# EAGLE schematic SNCHN_II-03A (EAGLE 5.11)
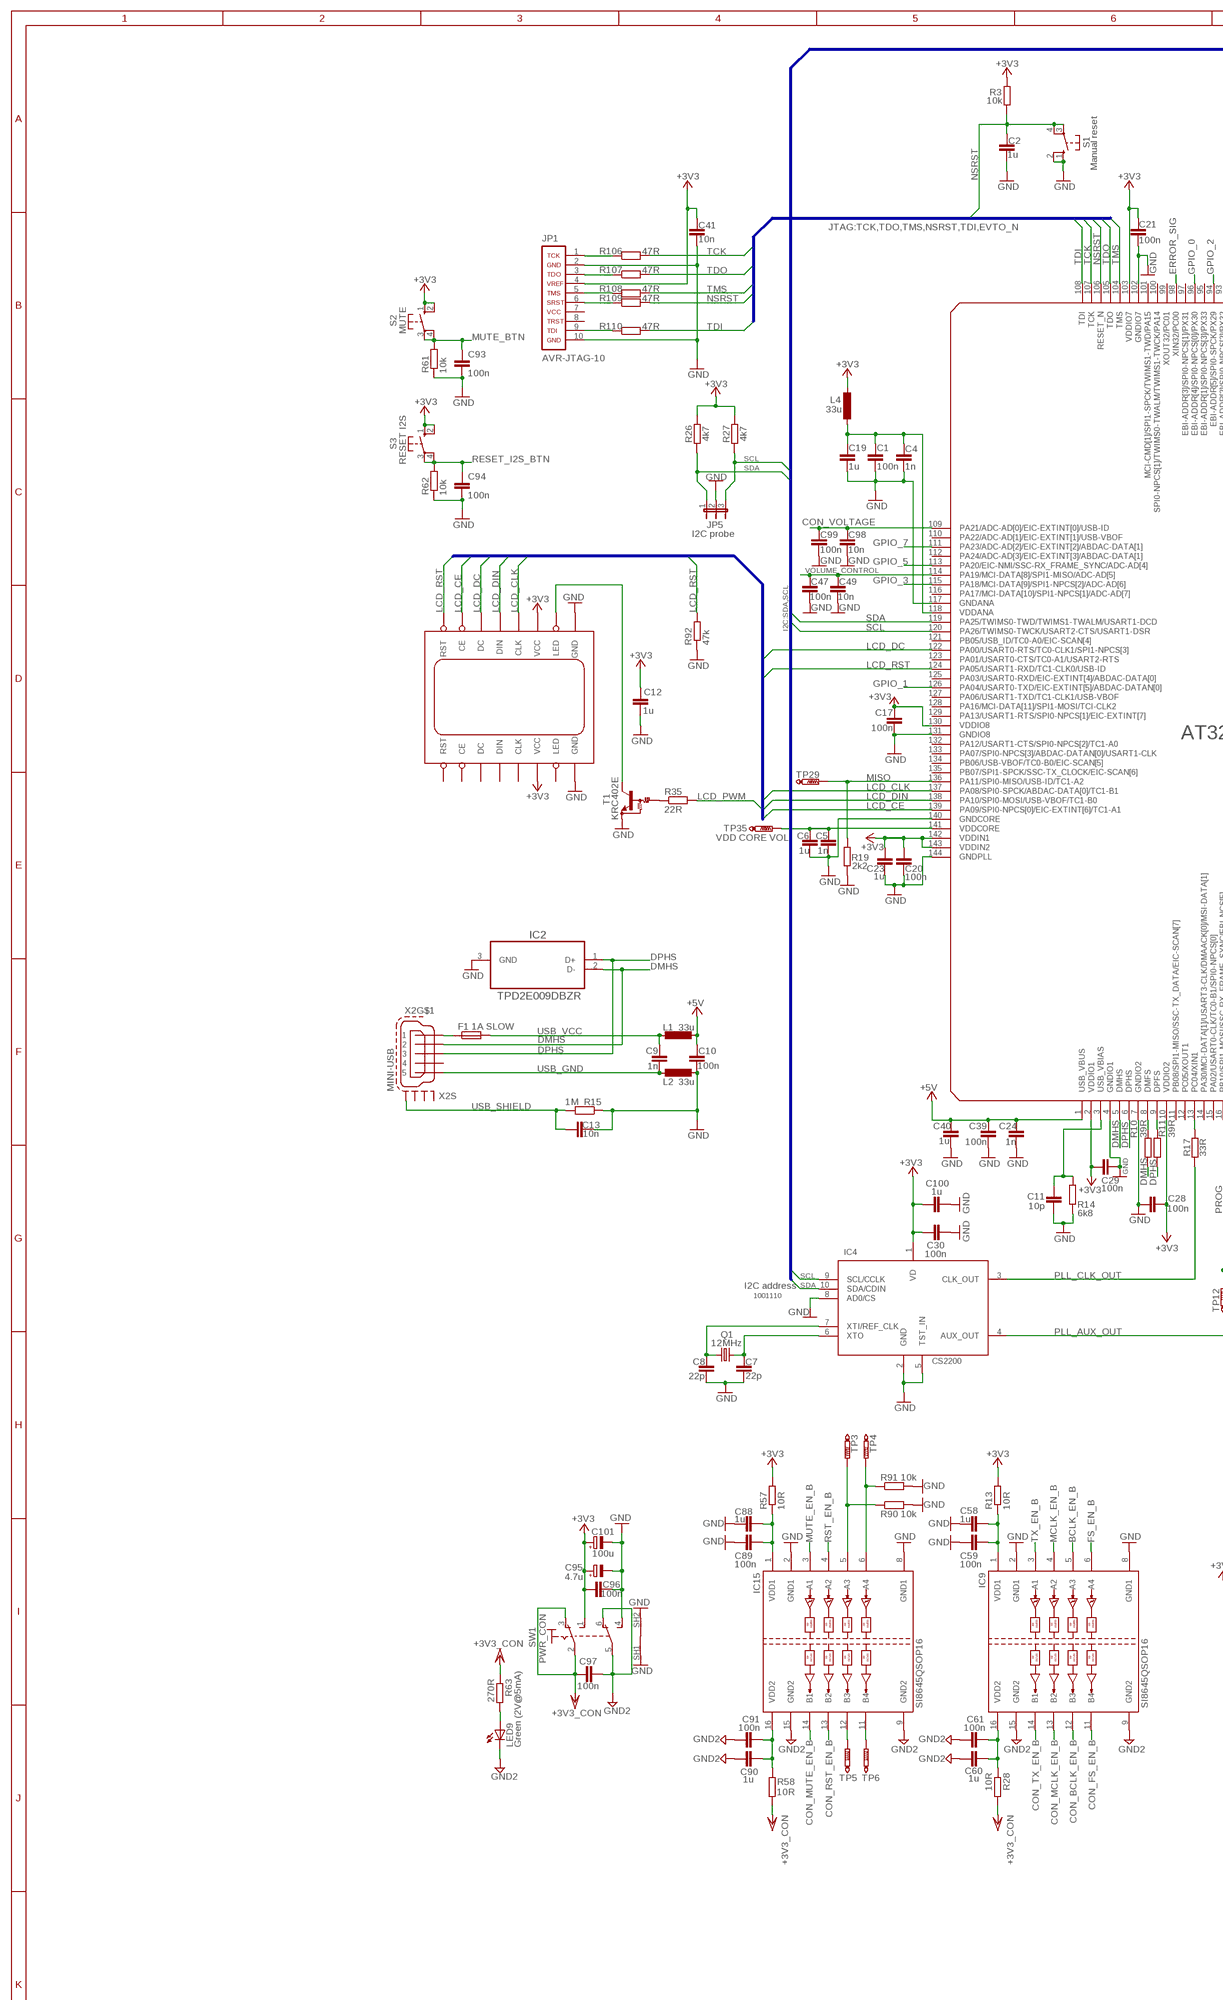
[diagram p0: schematic, sheet 1, part 1 of 3]
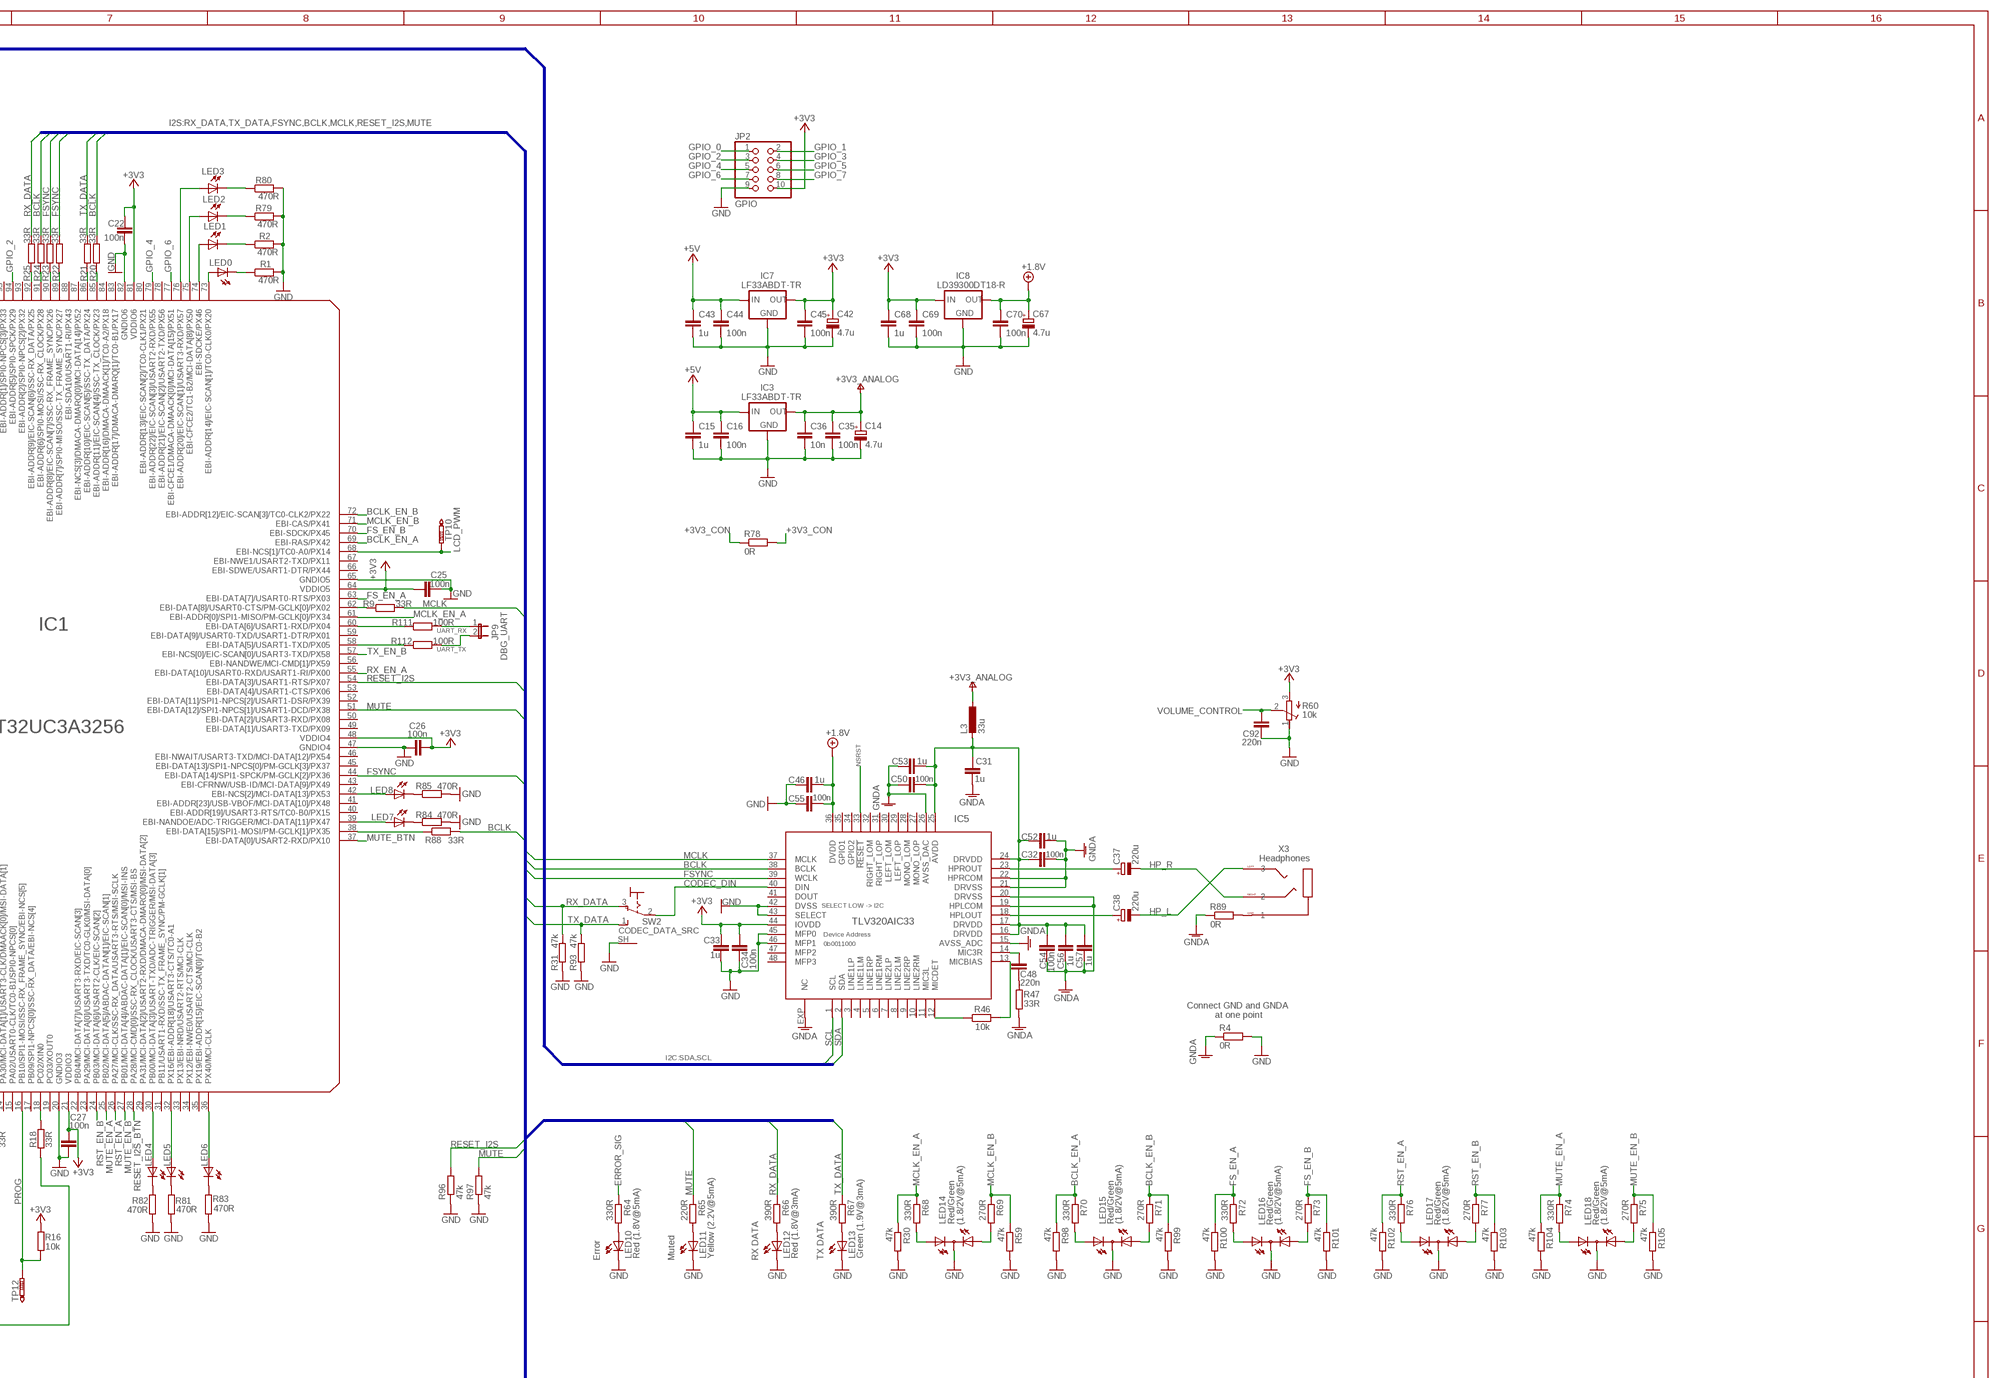
[diagram p1: schematic, sheet 1, part 2 of 3]
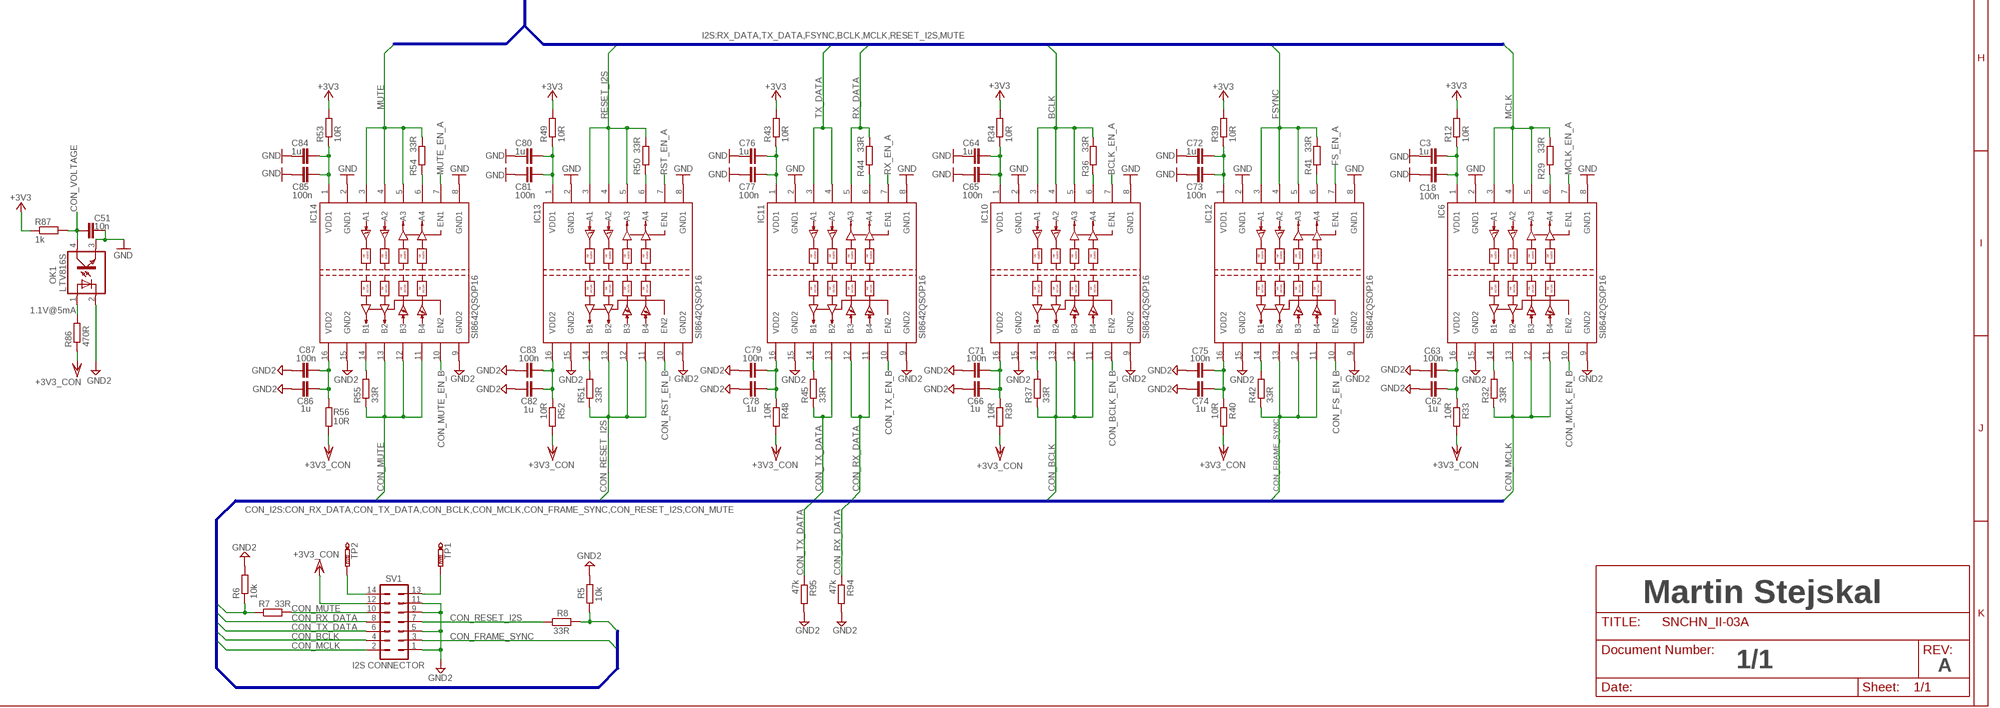
[diagram p2: schematic, sheet 1, part 3 of 3]

## Parts
C1  100n  C-EUC0402  [C0402]
C2  1u  C-EUC0603  [C0603]
C3  1u  C-EUC0603  [C0603]
C4  1n  C-EUC0402  [C0402]
C5  1n  C-EUC0402  [C0402]
C6  1u  C-EUC0603  [C0603]
C7  22p  C-EUC0603  [C0603]
C8  22p  C-EUC0603  [C0603]
C9  1n  C-EUC0603  [C0603]
C10  100n  C-EUC0603  [C0603]
C11  10p  C-EUC0402  [C0402]
C12  1u  C-EUC0603  [C0603]
C13  10n  C-EUC0603  [C0603]
C14  4.7u  CPOL-EUSMCA  [SMC_A]
C15  1u  C0603R  [C0603R]
C16  100n  C-EUC0402  [C0402]
C17  100n  C-EUC0402  [C0402]
C18  100n  C-EUC0402  [C0402]
C19  1u  C-EUC0603  [C0603]
C20  100n  C-EUC0402  [C0402]
C21  100n  C-EUC0402  [C0402]
C22  100n  C-EUC0402  [C0402]
C23  1u  C-EUC0603  [C0603]
C24  1n  C-EUC0402  [C0402]
C25  100n  C-EUC0402  [C0402]
C26  100n  C-EUC0402  [C0402]
C27  100n  C-EUC0402  [C0402]
C28  100n  C-EUC0402  [C0402]
C29  100n  C-EUC0402  [C0402]
C30  100n  C-EUC0402  [C0402]
C31  1u  C-EUC0603  [C0603]
C32  100n  C-EUC0402  [C0402]
C33  1u  C-EUC0603  [C0603]
C34  100n  C-EUC0402  [C0402]
C35  100n  C-EUC0603  [C0603]
C36  10n  C-EUC0603  [C0603]
C37  220u  CPOL-EU140CLH-1010  [140CLH-1010]
C38  220u  CPOL-EU140CLH-1010  [140CLH-1010]
C39  100n  C-EUC0402  [C0402]
C40  1u  C-EUC0603  [C0603]
C41  10n  C-EUC0603  [C0603]
C42  4.7u  CPOL-EUSMCA  [SMC_A]
C43  1u  C0603R  [C0603R]
C44  100n  C-EUC0603  [C0603]
C45  100n  C-EUC0603  [C0603]
C46  1u  C-EUC0603  [C0603]
C47  100n  C-EUC0402  [C0402]
C48  220n  C-EUC0402  [C0402]
C49  10n  C-EUC0402  [C0402]
C50  100n  C-EUC0402  [C0402]
C51  10n  C-EUC0402  [C0402]
C52  1u  C-EUC0603  [C0603]
C53  1u  C-EUC0603  [C0603]
C54  100n  C-EUC0402  [C0402]
C55  100n  C-EUC0402  [C0402]
C56  1u  C-EUC0603  [C0603]
C57  1u  C-EUC0603  [C0603]
C58  1u  C-EUC0603  [C0603]
C59  100n  C-EUC0402  [C0402]
C60  1u  C-EUC0603  [C0603]
C61  100n  C-EUC0402  [C0402]
C62  1u  C-EUC0603  [C0603]
C63  100n  C-EUC0402  [C0402]
C64  1u  C-EUC0603  [C0603]
C65  100n  C-EUC0402  [C0402]
C66  1u  C-EUC0603  [C0603]
C67  4.7u  CPOL-EUSMCA  [SMC_A]
C68  1u  C0603R  [C0603R]
C69  100n  C-EUC0402  [C0402]
C70  100n  C-EUC0402  [C0402]
C71  100n  C-EUC0402  [C0402]
C72  1u  C-EUC0603  [C0603]
C73  100n  C-EUC0402  [C0402]
C74  1u  C-EUC0603  [C0603]
C75  100n  C-EUC0402  [C0402]
C76  1u  C-EUC0603  [C0603]
C77  100n  C-EUC0402  [C0402]
C78  1u  C-EUC0603  [C0603]
C79  100n  C-EUC0402  [C0402]
C80  1u  C-EUC0603  [C0603]
C81  100n  C-EUC0402  [C0402]
C82  1u  C-EUC0603  [C0603]
C83  100n  C-EUC0402  [C0402]
C84  1u  C-EUC0603  [C0603]
C85  100n  C-EUC0402  [C0402]
C86  1u  C-EUC0603  [C0603]
C87  100n  C-EUC0402  [C0402]
C88  1u  C-EUC0603  [C0603]
C89  100n  C-EUC0402  [C0402]
C90  1u  C-EUC0603  [C0603]
C91  100n  C-EUC0402  [C0402]
C92  220n  C-EUC0402  [C0402]
C93  100n  C-EUC0402  [C0402]
C94  100n  C-EUC0402  [C0402]
C95  4.7u  CPOL-EUSMCA  [SMC_A]
C96  100n  C-EUC0402  [C0402]
C97  100n  C-EUC0402  [C0402]
C98  10n  C-EUC0402  [C0402]
C99  100n  C-EUC0402  [C0402]
C100  1u  C-EUC0603  [C0603]
C101  100u  CPOL-EUSMCD  [SMC_D]
DISPLAY  LCD_NOKIA_5510  [LCD_NOKIA_5510_PLUS_EXT_BRD]
F1  1A SLOW  R-EU_M1206  [M1206]
IC1  AT32UC3A3256  AT32UC3A3256/3128/364  [LQFP144]
IC2  TPD2E009DBZR  [SOT95P237X112-3N]
IC3  LF33ABDT-TR  LP2950CDTX-3.3  [DPACK]
IC4  CS2200  [MSOP10]
IC5  TLV320AIC33  [QFN48]
IC6  SI8642QSOP16  [QSOP16]
IC7  LF33ABDT-TR  LP2950CDTX-3.3  [DPACK]
IC8  LD39300DT18-R  LP2950CDTX-3.3  [DPACK]
IC9  SI8645QSOP16  [QSOP16]
IC10  SI8642QSOP16  [QSOP16]
IC11  SI8642QSOP16  [QSOP16]
IC12  SI8642QSOP16  [QSOP16]
IC13  SI8642QSOP16  [QSOP16]
IC14  SI8642QSOP16  [QSOP16]
IC15  SI8645QSOP16  [QSOP16]
JP1  AVR-JTAG-10  [AVR-JTAG-10]
JP2  GPIO  PINHD-2X5  [2X05]
JP5  I2C probe  JP2E  [JP2]
JP9  DBG_UART  JP1E  [JP1]
L1  33u  L0805  [L0805]
L2  33u  L0805  [L0805]
L3  33u  L0805  [L0805]
L4  33u  L0805  [L0805]
LED0  LEDCHIP-LED0603  [CHIP-LED0603]
LED1  LEDCHIP-LED0603  [CHIP-LED0603]
LED2  LEDCHIP-LED0603  [CHIP-LED0603]
LED3  LEDCHIP-LED0603  [CHIP-LED0603]
LED4  LEDCHIP-LED0603  [CHIP-LED0603]
LED5  LEDCHIP-LED0603  [CHIP-LED0603]
LED6  LEDCHIP-LED0603  [CHIP-LED0603]
LED7  LEDCHIP-LED0603  [CHIP-LED0603]
LED8  LEDCHIP-LED0603  [CHIP-LED0603]
LED9  Green (2V@5mA)  LED3MM  [LED3MM]
LED10  Red (1.8V@5mA)  LED3MM  [LED3MM]
LED11  Yellow (2.2V@5mA)  LED3MM  [LED3MM]
LED12  Red (1.8V@3mA)  LED3MM  [LED3MM]
LED13  Green (1.9V@3mA)  LED3MM  [LED3MM]
LED14  Red/Green  DUO_LED_C3MM  [DUOLED-C-3MM]
LED15  Red/Green  DUO_LED_C3MM  [DUOLED-C-3MM]
LED16  Red/Green  DUO_LED_C3MM  [DUOLED-C-3MM]
LED17  Red/Green  DUO_LED_C3MM  [DUOLED-C-3MM]
LED18  Red/Green  DUO_LED_C3MM  [DUOLED-C-3MM]
OK1  LTV816S  [SMD4]
Q1  12MHz  CRYSTALHC49U-V  [HC49U-V]
R1  470R  R-EU_R0402  [R0402]
R2  470R  R-EU_R0402  [R0402]
R3  10k  R-EU_R0603  [R0603]
R4  0R  R-EU_R1206  [R1206]
R5  10k  R-EU_R0603  [R0603]
R6  10k  R-EU_R0603  [R0603]
R7  33R  R-EU_R0603  [R0603]
R8  33R  R-EU_R0603  [R0603]
R9  33R  R-EU_R0402  [R0402]
R10  39R  R-EU_R0603  [R0603]
R11  39R  R-EU_R0603  [R0603]
R12  10R  R-EU_R0603  [R0603]
R13  10R  R-EU_R0603  [R0603]
R14  6k8  R-EU_R0402  [R0402]
R15  1M  R-EU_R0603  [R0603]
R16  10k  R-EU_R0402  [R0402]
R17  33R  R-EU_R0402  [R0402]
R18  33R  R-EU_R0402  [R0402]
R19  2k2  R-EU_R0402  [R0402]
R20  33R  R-EU_R0402  [R0402]
R21  33R  R-EU_R0402  [R0402]
R22  33R  R-EU_R0402  [R0402]
R23  33R  R-EU_R0402  [R0402]
R24  33R  R-EU_R0402  [R0402]
R25  33R  R-EU_R0402  [R0402]
R26  4k7  R-EU_R0603  [R0603]
R27  4k7  R-EU_R0603  [R0603]
R28  10R  R-EU_R0603  [R0603]
R29  33R  R-EU_R0402  [R0402]
R30  47k  R-EU_R0603  [R0603]
R31  47k  R-EU_R0402  [R0402]
R32  33R  R-EU_R0402  [R0402]
R33  10R  R-EU_R0603  [R0603]
R34  10R  R-EU_R0603  [R0603]
R35  22R  R-EU_R0603  [R0603]
R36  33R  R-EU_R0402  [R0402]
R37  33R  R-EU_R0402  [R0402]
R38  10R  R-EU_R0603  [R0603]
R39  10R  R-EU_R0603  [R0603]
R40  10R  R-EU_R0603  [R0603]
R41  33R  R-EU_R0402  [R0402]
R42  33R  R-EU_R0402  [R0402]
R43  10R  R-EU_R0603  [R0603]
R44  33R  R-EU_R0402  [R0402]
R45  33R  R-EU_R0402  [R0402]
R46  10k  R-EU_R0402  [R0402]
R47  33R  R-EU_R0402  [R0402]
R48  10R  R-EU_R0603  [R0603]
R49  10R  R-EU_R0603  [R0603]
R50  33R  R-EU_R0402  [R0402]
R51  33R  R-EU_R0402  [R0402]
R52  10R  R-EU_R0603  [R0603]
R53  10R  R-EU_R0603  [R0603]
R54  33R  R-EU_R0402  [R0402]
R55  33R  R-EU_R0402  [R0402]
R56  10R  R-EU_R0603  [R0603]
R57  10R  R-EU_R0603  [R0603]
R58  10R  R-EU_R0603  [R0603]
R59  47k  R-EU_R0603  [R0603]
R60  10k  R-TRIMALPSRK09K1110AK4  [TRIM_RK09K1110AK4]
R61  10k  R-EU_R0402  [R0402]
R62  10k  R-EU_R0402  [R0402]
R63  270R  R-EU_R0603  [R0603]
R64  330R  R-EU_R0603  [R0603]
R65  220R  R-EU_R0603  [R0603]
R66  390R  R-EU_R0603  [R0603]
R67  390R  R-EU_R0603  [R0603]
R68  330R  R-EU_R0603  [R0603]
R69  270R  R-EU_R0603  [R0603]
R70  330R  R-EU_R0603  [R0603]
R71  270R  R-EU_R0603  [R0603]
R72  330R  R-EU_R0603  [R0603]
R73  270R  R-EU_R0603  [R0603]
R74  330R  R-EU_R0603  [R0603]
R75  270R  R-EU_R0603  [R0603]
R76  330R  R-EU_R0603  [R0603]
R77  270R  R-EU_R0603  [R0603]
R78  0R  R-EU_R1206  [R1206]
R79  470R  R-EU_R0402  [R0402]
R80  470R  R-EU_R0402  [R0402]
R81  470R  R-EU_R0402  [R0402]
R82  470R  R-EU_R0402  [R0402]
R83  470R  R-EU_R0402  [R0402]
R84  470R  R-EU_R0402  [R0402]
R85  470R  R-EU_R0402  [R0402]
R86  470R  R-EU_R0402  [R0402]
R87  1k  R-EU_R0603  [R0603]
R88  33R  R-EU_R0402  [R0402]
R89  0R  R-EU_R0603  [R0603]
R90  10k  R-EU_R0402  [R0402]
R91  10k  R-EU_R0402  [R0402]
R92  47k  R-EU_R0402  [R0402]
R93  47k  R-EU_R0402  [R0402]
R94  47k  R-EU_R0402  [R0402]
R95  47k  R-EU_R0402  [R0402]
R96  47k  R-EU_R0603  [R0603]
R97  47k  R-EU_R0603  [R0603]
R98  47k  R-EU_R0603  [R0603]
R99  47k  R-EU_R0603  [R0603]
R100  47k  R-EU_R0603  [R0603]
R101  47k  R-EU_R0603  [R0603]
R102  47k  R-EU_R0603  [R0603]
R103  47k  R-EU_R0603  [R0603]
R104  47k  R-EU_R0603  [R0603]
R105  47k  R-EU_R0603  [R0603]
R106  47R  R-EU_R0402  [R0402]
R107  47R  R-EU_R0402  [R0402]
R108  47R  R-EU_R0402  [R0402]
R109  47R  R-EU_R0603  [R0603]
R110  47R  R-EU_R0402  [R0402]
R111  100R  R-EU_R0402  [R0402]
R112  100R  R-EU_R0402  [R0402]
S1  Manual reset  10-XX  [B3F-10XX]
S2  MUTE  10-XX  [B3F-10XX]
S3  RESET I2S  10-XX  [B3F-10XX]
SV1  I2S CONNECTOR  ML14L  [ML14L]
SW1  PWR_CON  THROUGH_HOLE_2_POLES_SHILEDTOOGLE_SWITCH  [1MD3T2B4M7XX]
SW2  CODEC_DATA_SRC  THROUGH_HOLE_1_POLE_SHIELD_1XTOOGLE_SWITCH  [2AS2T2A1M7RE]
T1  KRC402E  MUN2211T1-NPN_DRIVER-SC59-BEC  [SC59-BEC]
TP1  PTR1B1,27  [B1,27]
TP2  PTR1B1,27  [B1,27]
TP3  PTR1TP06R  [TP06R]
TP4  PTR1TP06R  [TP06R]
TP5  PTR1TP06R  [TP06R]
TP6  PTR1TP06R  [TP06R]
TP10  PTR1B1,27  [B1,27]
TP12  PTR1PAD1-13  [P1-13]
TP29  PTR1B1,27  [B1,27]
TP35  PTR1B1,27  [B1,27]
X2  MINI-USB  MINI-USB-SCHIELD-32005-201  [32005-201]
X3  Headphones  JACK_CON_3.5MM_3PIN  [STEREO_JACK_3.5MM_SMD_SJ-352X-SMT]

## Nets
+1.8V: C46.1 C55.1 C67.+ C70.1 IC5.36(DVDD) IC8.3(OUT)
+3V3: C12.1 C17.1 C20.1 C21.1 C22.1 C23.1 C25.1 C26.1 C27.1 C28.2 C29.1 C30.1 C33.1 C34.1 C41.1 C42.+ C45.1 C68.1 C69.1 C95.+ C96.1 C100.1 C101.+ DISPLAY.6(VCC) DISPLAY.6@1(VCC) IC1.2(VDDIO1) IC1.10(VDDIO2) IC1.21(VDDIO3) IC1.48(VDDIO4) IC1.64(VDDIO5) IC1.81(VDDIO6) IC1.103(VDDIO7) IC1.130(VDDIO8) IC1.142(VDDIN1) IC1.143(VDDIN2) IC4.1(VD) IC5.44(IOVDD) IC7.3(OUT) IC8.1(IN) JP1.4 JP2.10 L4.2 R3.2 R12.2 R13.2 R16.2 R26.2 R27.2 R34.2 R39.2 R43.2 R49.2 R53.2 R57.2 R60.3 R87.1 S2.1(S) S2.2(S1) S3.1(S) S3.2(S1) SW1.1(S)
+3V3_ANALOG: C14.+ C35.1 C36.1 IC3.3(OUT) L3.1
+3V3_CON: C97.1 R28.2 R33.2 R38.2 R40.2 R48.2 R52.2 R56.2 R58.2 R63.1 R78.1 R78.2 R86.1 SV1.12 SW1.2(P) SW1.3(O)
+5V: C10.1 C15.1 C16.1 C24.1 C39.1 C40.1 C43.1 C44.1 IC1.1(USB_VBUS) IC3.1(IN) IC7.1(IN) L1.2
ANALOG_VCC: C31.1 C32.2 C50.1 C52.2 C53.1 C54.2 C56.2 C57.2 IC5.16(DRVDD) IC5.17(DRVDD) IC5.24(DRVDD) IC5.25(AVDD) L3.2
BCLK [High Speed]: IC5.38(BCLK) IC10.3(A1) IC10.4(A2) IC10.5(A3) R20.2 R24.2 R36.2 R88.2
BCLK_EN_A: IC1.69(EBI-RAS/PX42) IC10.7(EN1) R70.1 R98.1
BCLK_EN_B: IC1.72(EBI-ADDR[12]/EIC-SCAN[3]/TC0-CLK2/PX22) IC9.5(A3) R71.1 R99.1
CODEC_DIN: IC5.40(DIN) SW2.2(P)
CON_BCLK [High Speed]: IC10.11(B4) IC10.12(B3) IC10.13(B2) R37.1 SV1.4
CON_BCLK_EN_B: IC9.12(B3) IC10.10(EN2)
CON_FRAME_SYNC: IC12.11(B4) IC12.12(B3) IC12.13(B2) R42.1 SV1.3
CON_FS_EN_B: IC9.11(B4) IC12.10(EN2)
CON_MCLK [High Speed]: IC6.11(B4) IC6.12(B3) IC6.13(B2) R32.1 SV1.2
CON_MCLK_EN_B: IC6.10(EN2) IC9.13(B2)
CON_MUTE: IC14.11(B4) IC14.12(B3) IC14.13(B2) R6.1 R7.1 R55.1
CON_MUTE_EN_B: IC14.10(EN2) IC15.14(B1)
CON_RESET_I2S: IC13.11(B4) IC13.12(B3) IC13.13(B2) R5.1 R8.2 R51.1
CON_RST_EN_B: IC13.10(EN2) IC15.13(B2)
CON_RX_DATA [High Speed]: IC11.11(B4) IC11.12(B3) R94.1 SV1.8
CON_TX_DATA [High Speed]: IC11.13(B2) R45.1 R95.1 SV1.6
CON_TX_EN_B: IC9.14(B1) IC11.10(EN2)
CON_VOLTAGE: C51.1 C98.1 C99.1 IC1.109(PA21/ADC-AD[0]/EIC-EXTINT[0]/USB-ID) OK1.4(COL) R87.2
DMHS: IC1.5(DMHS) IC2.2(D-) R10.1 X2.2
DPHS: IC1.6(DPHS) IC2.1(D+) R11.1 X2.3
ERROR_SIG: IC1.98(XIN32/PC00) R64.1
FS_EN_A: IC1.63(EBI-DATA[7]/USART0-RTS/PX03) IC12.7(EN1) R72.1 R100.1
FS_EN_B: IC1.70(EBI-SDCK/PX45) IC9.6(A4) R73.1 R101.1
FSYNC: IC1.44(EBI-DATA[14]/SPI1-SPCK/PM-GCLK[2]/PX36) IC5.39(WCLK) IC12.3(A1) IC12.4(A2) IC12.5(A3) R22.2 R23.2 R41.2
GND: C1.2 C2.2 C3.2 C4.2 C5.2 C6.2 C7.2 C8.2 C10.2 C11.2 C12.2 C13.2 C14.- C15.2 C16.2 C17.2 C18.2 C19.2 C20.2 C21.2 C22.2 C23.2 C24.2 C25.2 C26.2 C27.2 C28.1 C29.2 C30.2 C33.2 C34.2 C35.2 C36.2 C39.2 C40.2 C41.2 C42.- C43.2 C44.2 C45.2 C46.2 C47.2 C49.2 C51.2 C55.2 C58.2 C59.2 C64.2 C65.2 C67.- C68.2 C69.2 C70.2 C72.2 C73.2 C76.2 C77.2 C80.2 C81.2 C84.2 C85.2 C88.2 C89.2 C92.2 C93.2 C94.2 C95.- C96.2 C98.2 C99.2 C100.2 C101.- DISPLAY.8(GND) DISPLAY.8@1(GND) IC1.4(GNDIO1) IC1.7(GNDIO2) IC1.20(GNDIO3) IC1.47(GNDIO4) IC1.65(GNDIO5) IC1.82(GNDIO6) IC1.102(GNDIO7) IC1.117(GNDANA) IC1.131(GNDIO8) IC1.140(GNDCORE) IC1.144(GNDPLL) IC2.3(GND) IC3.4(GND) IC4.2(GND) IC4.5(TST_IN) IC4.8(AD0/CS) IC5.42(DVSS) IC5.43(SELECT) IC5.45(MFP0) IC5.46(MFP1) IC6.2(GND1) IC6.8(GND1) IC7.4(GND) IC8.4(GND) IC9.2(GND1) IC9.8(GND1) IC10.2(GND1) IC10.8(GND1) IC11.2(GND1) IC11.8(GND1) IC12.2(GND1) IC12.8(GND1) IC13.2(GND1) IC13.8(GND1) IC14.2(GND1) IC14.8(GND1) IC15.2(GND1) IC15.8(GND1) JP1.2 JP1.10 JP2.9 JP5.2 L2.2 LED10.K(C) LED11.K(C) LED12.K(C) LED13.K(C) LED14.C LED15.C LED16.C LED17.C LED18.C OK1.3(EMIT) R1.2 R2.2 R4.2 R14.1 R15.1 R19.1 R30.2 R31.2 R59.2 R60.1 R61.1 R62.1 R79.2 R80.2 R81.2 R82.2 R83.2 R84.2 R85.2 R90.2 R91.2 R92.1 R93.2 R96.1 R97.1 R98.2 R99.2 R100.2 R101.2 R102.2 R103.2 R104.2 R105.2 S1.1(S) S1.2(S1) SW1.4(S1) SW1.SH1(B) SW1.SH2(B1) SW2.SH(B1) T1.E
GND2: C60.2 C61.2 C62.2 C63.2 C66.2 C71.2 C74.2 C75.2 C78.2 C79.2 C82.2 C83.2 C86.2 C87.2 C90.2 C91.2 C97.2 IC6.9(GND2) IC6.15(GND2) IC9.9(GND2) IC9.15(GND2) IC10.9(GND2) IC10.15(GND2) IC11.9(GND2) IC11.15(GND2) IC12.9(GND2) IC12.15(GND2) IC13.9(GND2) IC13.15(GND2) IC14.9(GND2) IC14.15(GND2) IC15.9(GND2) IC15.15(GND2) LED9.K(C) OK1.2(C) R5.2 R6.2 R94.2 R95.2 SV1.1 SV1.5 SV1.9 SV1.11 SW1.5(P1) SW1.6(O1)
GNDA: C31.2 C32.1 C50.2 C52.1 C53.2 C54.1 C56.1 C57.1 IC5.15(AVSS_ADC) IC5.19(HPLCOM) IC5.20(DRVSS) IC5.21(DRVSS) IC5.22(HPRCOM) IC5.26(AVSS_DAC) IC5.EXP(NC) R4.1 R47.2 R89.1
GPIO_0: IC1.96(EBI-ADDR[4]/SPI0-NPCS[0]/PX30) JP2.1
GPIO_1: IC1.126(PA04/USART0-TXD/EIC-EXTINT[5]/ABDAC-DATAN[0]) JP2.2
GPIO_2: IC1.94(EBI-ADDR[5]/SPI0-SPCK/PX29) JP2.3
GPIO_3: IC1.115(PA18/MCI-DATA[9]/SPI1-NPCS[2]/ADC-AD[6]) JP2.4
GPIO_4: IC1.79(EBI-ADDR[22]/EIC-SCAN[3]/USART2-RXD/PX55) JP2.5
GPIO_5: IC1.113(PA20/EIC-NMI/SSC-RX_FRAME_SYNC/ADC-AD[4]) JP2.6
GPIO_6: IC1.77(EBI-CFCE1/DMACA-DMAACK[0]/MCI-DATA[15]/PX51) JP2.7
GPIO_7: IC1.111(PA23/ADC-AD[2]/EIC-EXTINT[2]/ABDAC-DATA[1]) JP2.8
HP_L: C38.- X3.P$2
HP_R: C37.- X3.P$3
HPLOUT_TLV: C38.+ IC5.18(HPLOUT)
HPROUT_TLV: C37.+ IC5.23(HPROUT)
LCD_CE: DISPLAY.2(CE) IC1.139(PA09/SPI0-NPCS[0]/EIC-EXTINT[6]/TC1-A1)
LCD_CLK: DISPLAY.5(CLK) IC1.137(PA08/SPI0-SPCK/ABDAC-DATA[0]/TC1-B1)
LCD_DC: DISPLAY.3(DC) IC1.122(PA00/USART0-RTS/TC0-CLK1/SPI1-NPCS[3])
LCD_DIN: DISPLAY.4(DIN) IC1.138(PA10/SPI0-MOSI/USB-VBOF/TC1-B0)
LCD_PWM: IC1.68(EBI-NCS[1]/TC0-A0/PX14) R35.2 TP10.TP
LCD_RST: DISPLAY.1(RST) IC1.124(PA05/USART1-RXD/TC1-CLK0/USB-ID) R92.2
LED0: IC1.73(EBI-ADDR[14]/EIC-SCAN[1]/TC0-CLK0/PX20) LED0.A
LED1: IC1.74(EBI-SDCKE/PX46) LED1.A
LED2: IC1.75(EBI-CFCE2/TC1-B2/MCI-DATA[8]/PX50) LED2.A
LED3: IC1.76(EBI-ADDR[20]/EIC-SCAN[1]/USART3-RXD/PX57) LED3.A
MCLK [High Speed]: IC5.37(MCLK) IC6.3(A1) IC6.4(A2) IC6.5(A3) R9.2 R29.2
MCLK_EN_A: IC1.61(EBI-ADDR[0]/SPI1-MISO/PM-GCLK[0]/PX34) IC6.7(EN1) R30.1 R68.1
MCLK_EN_B: IC1.71(EBI-CAS/PX41) IC9.4(A2) R59.1 R69.1
MCLK_P48_N441: IC1.32(PX16/EBI-ADDR[18]/USART3-CTS/TC0-A1) LED5.A
MISO: IC1.136(PA11/SPI0-MISO/USB-ID/TC1-A2) R19.2 TP29.TP
MUTE: IC1.51(EBI-DATA[12]/SPI1-NPCS[1]/USART1-DCD/PX38) IC14.3(A1) IC14.4(A2) IC14.5(A3) R54.2 R65.1 R97.2
MUTE_BTN: C93.1 IC1.37(EBI-DATA[0]/USART2-RXD/PX10) R61.2 S2.3(P) S2.4(P1)
MUTE_EN_A: IC1.25(PB02/MCI-DATA[5]/ABDAC-DATAN[1]/EIC-SCAN[1]) IC14.7(EN1) R74.1 R104.1
MUTE_EN_B: IC1.27(PB01/MCI-DATA[4]/ABDAC-DATA[1]/EIC-SCAN[0]/MSI-INS) IC15.3(A1) R75.1 R105.1
N$1: C8.1 IC4.7(XTI/REF_CLK) Q1.1
N$2: IC1.13(PC04/XIN1) R17.2
N$3: C1.1 C4.1 C19.1 IC1.118(VDDANA) L4.1
N$4: R7.2 SV1.10
N$5: IC1.62(EBI-DATA[8]/USART0-CTS/PM-GCLK[0]/PX02) R9.1
N$6: C3.1 C18.1 IC6.1(VDD1) R12.1
N$7: SV1.14 TP2.TP
N$8: IC1.18(PC02/XIN0) R18.2
N$9: SV1.13 TP1.TP
N$10: IC5.12(MICDET) R46.1
N$11 [High Speed]: IC1.85(EBI-ADDR[11]/EIC-SCAN[4]/SSC-TX_CLOCK/PX23) R20.1
N$12: IC1.86(EBI-ADDR[10]/EIC-SCAN[5]/SSC-TX_DATA/PX24) R21.1
N$13: IC1.89(EBI-ADDR[7]/SPI0-MISO/SSC-TX_FRAME_SYNC/PX27) R22.1
N$14: IC1.90(EBI-ADDR[8]/EIC-SCAN[7]/SSC-RX_FRAME_SYNC/PX26) R23.1
N$15 [High Speed]: IC1.91(EBI-ADDR[6]/SPI0-MOSI/SSC-RX_CLOCK/PX28) R24.1
N$16: IC1.92(EBI-ADDR[9]/EIC-SCAN[6]/SSC-RX_DATA/PX25) R25.1
N$17: F1.1 X2.1
N$18: IC5.13(MICBIAS) R46.2
N$19: R8.1 SV1.7
N$20: R35.1 T1.B
N$21: DISPLAY.7(LED) T1.C
N$22: C58.1 C59.1 IC9.1(VDD1) R13.1
N$23: C62.1 C63.1 IC6.16(VDD2) R33.1
N$24: C60.1 C61.1 IC9.16(VDD2) R28.1
N$25: IC6.6(A4) R29.1
N$26: C64.1 C65.1 IC10.1(VDD1) R34.1
N$27: JP1.1 R106.1
N$28 [High Speed]: IC6.14(B1) R32.2
N$29: IC10.6(A4) R36.1
N$30 [High Speed]: IC10.14(B1) R37.2
N$31: C66.1 C71.1 IC10.16(VDD2) R38.1
N$32: IC12.6(A4) R41.1
N$33: IC12.14(B1) R42.2
N$34: C76.1 C77.1 IC11.1(VDD1) R43.1
N$35: C72.1 C73.1 IC12.1(VDD1) R39.1
N$36: C74.1 C75.1 IC12.16(VDD2) R40.1
N$37: IC11.6(A4) R44.1
N$38: C48.1 IC5.14(MIC3R)
N$39: IC11.14(B1) R45.2
N$40: C78.1 C79.1 IC11.16(VDD2) R48.1
N$41: C88.1 C89.1 IC15.1(VDD1) R57.1
N$42: C90.1 C91.1 IC15.16(VDD2) R58.1
N$43: JP1.3 R107.1
N$44: C80.1 C81.1 IC13.1(VDD1) R49.1
N$45: IC13.6(A4) R50.1
N$46: IC13.14(B1) R51.2
N$47: C82.1 C83.1 IC13.16(VDD2) R52.1
N$48: C84.1 C85.1 IC14.1(VDD1) R53.1
N$49: IC14.6(A4) R54.1
N$50: IC14.14(B1) R55.2
N$51: C86.1 C87.1 IC14.16(VDD2) R56.1
N$52: LED9.A R63.2
N$53: R89.2 X3.P$1
N$54: IC15.12(B3) TP5.TP
N$55: LED10.A R64.2
N$56: C48.2 R47.1
N$59: IC15.6(A4) R91.1 TP4.TP
N$60: IC15.5(A3) R90.1 TP3.TP
N$61: LED11.A R65.2
N$62: LED12.A R66.2
N$63: IC15.11(B4) TP6.TP
N$64: JP1.9 R110.1
N$65: LED13.A R67.2
N$66: LED14.AX R68.2
N$67: C11.1 IC1.3(USB_VBIAS) R14.2
N$68: LED14.AR R69.2
N$69: IC1.8(DMFS) R10.2
N$70: LED15.AX R70.2
N$71: LED15.AR R71.2
N$72: LED16.AX R72.2
N$73: LED16.AR R73.2
N$74: IC1.9(DPFS) R11.2
N$75: LED18.AX R74.2
N$76: LED18.AR R75.2
N$77: LED17.AX R76.2
N$78: LED17.AR R77.2
N$79: LED2.C R79.1
N$80: LED1.C R2.1
N$81: LED3.C R80.1
N$82: LED0.C R1.1
N$83: C7.1 IC4.6(XTO) Q1.2
N$84: LED5.C R81.1
N$85: LED4.C R82.1
N$86: IC1.30(PB00/MCI-DATA[3]/USART-TXD/ADC-TRIGGER/MSI-DATA[3]) LED4.A
N$87: LED6.C R83.1
N$88: IC1.36(PX40/MCI-CLK) LED6.A
N$89: LED7.C R84.1
N$90: IC1.39(EBI-NANDOE/ADC-TRIGGER/MCI-DATA[11]/PX47) LED7.A
N$91: LED8.C R85.1
N$92: IC1.42(EBI-NCS[2]/MCI-DATA[13]/PX53) LED8.A
N$93: OK1.1(A) R86.2
N$94 [High Speed]: IC1.38(EBI-DATA[15]/SPI1-MOSI/PM-GCLK[1]/PX35) R88.1
N$95: JP1.6 R109.1
N$96: JP1.5 R108.1
N$97: IC1.60(EBI-DATA[6]/USART1-RXD/PX04) R111.1
N$98: IC1.58(EBI-DATA[5]/USART1-TXD/PX05) R112.1
NSRST: C2.1 IC1.106(RESET_N) IC5.33(!RESET) R3.1 R109.2 S1.3(P) S1.4(P1)
PLL_AUX_OUT: IC4.4(AUX_OUT) R18.1
PLL_CLK_OUT: IC4.3(CLK_OUT) R17.1
PROG: IC1.16(PB10/SPI1-MOSI/SSC-RX_FRAME_SYNC/EBI-NCS[5]) R16.1 TP12.TP
RESET_I2S: IC1.54(EBI-DATA[3]/USART1-RTS/PX07) IC13.3(A1) IC13.4(A2) IC13.5(A3) R50.2 R96.2
RESET_I2S_BTN: C94.1 IC1.28(PA28/MCI-CMD[0]/SSC-RX_CLOCK/USART3-CTS/MSI-BS) R62.2 S3.3(P) S3.4(P1)
RST_EN_A: IC1.26(PA27/MCI-CLK/SSC-RX_DATA/USART3-RTS/MSI-SCLK) IC13.7(EN1) R76.1 R102.1
RST_EN_B: IC1.24(PB03/MCI-DATA[6]/USART2-CLK/EIC-SCAN[2]) IC15.4(A2) R77.1 R103.1
RX_DATA [High Speed]: IC11.5(A3) R25.2 R31.1 R44.2 R66.1 SW2.3(O)
RX_EN_A: IC1.55(EBI-DATA[10]/USART0-RXD/USART1-RI/PX00) IC11.7(EN1)
SCL: IC1.120(PA26/TWIMS0-TWCK/USART2-CTS/USART1-DSR) IC4.9(SCL/CCLK) IC5.1(SCL) JP5.3 R27.1
SDA: IC1.119(PA25/TWIMS0-TWD/TWIMS1-TWALM/USART1-DCD) IC4.10(SDA/CDIN) IC5.2(SDA) JP5.1 R26.1
TCK: IC1.107(TCK) R106.2
TDI: IC1.108(TDI) R110.2
TDO: IC1.105(TDO) R107.2
TMS: IC1.104(TMS) R108.2
TX_DATA [High Speed]: IC11.3(A1) IC11.4(A2) R21.2 R67.1 R93.1 SW2.1(S)
TX_EN_B: IC1.57(EBI-NCS[0]/EIC-SCAN[0]/USART3-TXD/PX58) IC9.3(A1)
UART_RX: JP9.1 R111.2
UART_TX: JP9.2 R112.2
USB_GND: C9.2 L2.1 X2.5
USB_SHIELD: C13.1 R15.2 X2.M4(S:S4)
USB_VCC: C9.1 F1.2 L1.1
VDDCORE: C5.1 C6.1 IC1.141(VDDCORE) TP35.TP
VOLUME_CONTROL: C47.1 C49.1 C92.1 IC1.114(PA19/MCI-DATA[8]/SPI1-MISO/ADC-AD[5]) R60.2
Unconnected: DISPLAY.1@1(RST) DISPLAY.2@1(CE) DISPLAY.3@1(DC) DISPLAY.4@1(DIN) DISPLAY.5@1(CLK) DISPLAY.7@1(LED) IC1.11(PB08/SPI1-MISO/SSC-TX_DATA/EIC-SCAN[7]) IC1.12(PC05/XOUT1) IC1.14(PA30/MCI-DATA[1]/USART3-CLK/DMAACK[0]/MSI-DATA[1]) IC1.15(PA02/USART0-CLK/TC0-B1/SPI0-NPCS[0]) IC1.17(PB09/SPI1-NPCS[0]/SSC-RX_DATA/EBI-NCS[4]) IC1.19(PC03/XOUT0) IC1.22(PB04/MCI-DATA[7]/USART3-RXD/EIC-SCAN[3]) IC1.23(PA29/MCI-DATA[0]/USART3-TXD/TC0-GLK0/MSI-DATA[0]) IC1.29(PA31/MCI-DATA[2]/USART2-RXD/DMACA-DMARO[0]/MSI-DATA[2]) IC1.31(PB11/USART1-RXD/SSC-TX_FRAME_SYNC/PM-GCLK[1]) IC1.33(PX13/EBI-NRD/USART2-RTS/MCI-CLK) IC1.34(PX12/EBI-NWE0/USART2-CTS/MCI-CLK) IC1.35(PX19/EBI-ADDR[15]/EIC-SCAN[0]/TC0-B2) IC1.40(EBI-ADDR[19]/USART3-RTS/TC0-B0/PX15) IC1.41(EBI-ADDR[23]/USB-VBOF/MCI-DATA[10]/PX48) IC1.43(EBI-CFRNW/USB-ID/MCI-DATA[9]/PX49) IC1.45(EBI-DATA[13]/SPI1-NPCS[0]/PM-GCLK[3]/PX37) IC1.46(EBI-NWAIT/USART3-TXD/MCI-DATA[12]/PX54) IC1.49(EBI-DATA[1]/USART3-TXD/PX09) IC1.50(EBI-DATA[2]/USART3-RXD/PX08) IC1.52(EBI-DATA[11]/SPI1-NPCS[2]/USART1-DSR/PX39) IC1.53(EBI-DATA[4]/USART1-CTS/PX06) IC1.56(EBI-NANDWE/MCI-CMD[1]/PX59) IC1.59(EBI-DATA[9]/USART0-TXD/USART1-DTR/PX01) IC1.66(EBI-SDWE/USART1-DTR/PX44) IC1.67(EBI-NWE1/USART2-TXD/PX11) IC1.78(EBI-ADDR[21]/EIC-SCAN[2]/USART2-TXD/PX56) IC1.80(EBI-ADDR[13]/EIC-SCAN[2]/TC0-CLK1/PX21) IC1.83(EBI-ADDR[17]/DMACA-DMARQ[1]/TC0-B1/PX17) IC1.84(EBI-ADDR[16]/DMACA-DMAACK[1]/TC0-A2/PX18) IC1.87(EBI-NCS[3]/DMACA-DMARQ[0]/MCI-DATA[14]/PX52) IC1.88(EBI-SDA10/USART1-RI/PX43) IC1.93(EBI-ADDR[2]/SPI0-NPCS[2]/PX32) IC1.95(EBI-ADDR[1]/SPI0-NPCS[3]/PX33) IC1.97(EBI-ADDR[3]/SPI0-NPCS[1]/PX31) IC1.99(XOUT32/PC01) IC1.100(SPI0-NPCS[1]/TWIMS0-TWALM/TWIMS1-TWCK/PA14) IC1.101(MCI-CMD[1]/SPI1-SPCK/TWIMS1-TWD/PA15) IC1.110(PA22/ADC-AD[1]/EIC-EXTINT[1]/USB-VBOF) IC1.112(PA24/ADC-AD[3]/EIC-EXTINT[3]/ABDAC-DATA[1]) IC1.116(PA17/MCI-DATA[10]/SPI1-NPCS[1]/ADC-AD[7]) IC1.121(PB05/USB_ID/TC0-A0/EIC-SCAN[4]) IC1.123(PA01/USART0-CTS/TC0-A1/USART2-RTS) IC1.125(PA03/USART0-RXD/EIC-EXTINT[4]/ABDAC-DATA[0]) IC1.127(PA06/USART1-TXD/TC1-CLK1/USB-VBOF) IC1.128(PA16/MCI-DATA[11]/SPI1-MOSI/TCI-CLK2) IC1.129(PA13/USART1-RTS/SPI0-NPCS[1]/EIC-EXTINT[7]) IC1.132(PA12/USART1-CTS/SPI0-NPCS[2]/TC1-A0) IC1.133(PA07/SPI0-NPCS[3]/ABDAC-DATAN[0]/USART1-CLK) IC1.134(PB06/USB-VBOF/TC0-B0/EIC-SCAN[5]) IC1.135(PB07/SPI1-SPCK/SSC-TX_CLOCK/EIC-SCAN[6]) IC5.3(LINE1LP) IC5.4(LINE1LM) IC5.5(LINE1RP) IC5.6(LINE1RM) IC5.7(LINE2LP) IC5.8(LINE2LM) IC5.9(LINE2RP) IC5.10(LINE2RM) IC5.11(MIC3L) IC5.27(MONO_LOP) IC5.28(MONO_LOM) IC5.29(LEFT_LOP) IC5.30(LEFT_LOM) IC5.31(RIGHT_LOP) IC5.32(RIGHT_LOM) IC5.34(GPIO2) IC5.35(GPIO1) IC5.41(DOUT) IC5.47(MFP2) IC5.48(MFP3) JP1.7 JP1.8 X2.4 X2.M1(S:S1) X2.M2(S:S2) X2.M3(S:S3)

## Buses
JTAG:TCK,TDO,TMS,NSRST,TDI,EVTO_N
I2S:RX_DATA,TX_DATA,FSYNC,BCLK,MCLK,RESET_I2S,MUTE
CON_I2S:CON_RX_DATA,CON_TX_DATA,CON_BCLK,CON_MCLK,CON_FRAME_SYNC,CON_RESET_I2S,CON_MUTE
I2C:SDA,SCL
LCD_5510:LCD_RST,LCD_CE,LCD_DC,LCD_DIN,LCD_CLK,LCD_PWM

## Notes on the sheet
- VDD CORE VOL.
- SELECT LOW -> I2C
- Device Address
- 0b0011000
- Connect GND and GNDA
- at one point
- (1.8/2V@5mA) | (1.8/2V@5mA) | (1.8/2V@5mA) | (1.8/2V@5mA) | (1.8/2V@5mA)
- Error | Muted | RX DATA | TX DATA
- I2C address
- 1001110
- 1.1V@5mA
- Martin Stejskal
- 1/1 | A

## Library data of the parts
C1-C13 C16-C36 C39-C41 C44-C66 C69-C94 C96-C100 = rcl:C-EU: CAPACITOR, European symbol
C14 C37 C38 C42 C67 C95 C101 = rcl:CPOL-EU: POLARIZED CAPACITOR, European symbol
C15 C43 C68 = _ALCZ_Passives:C: Ordinary capacitors
DISPLAY = _ALCZ_Display:LCD_NOKIA_5510: Display from NOKIA 5510 Used SPI interface up to 4Mbit/s. LED backlight is turned on by LOW level!
F1 R1-R59 R61-R112 = rcl:R-EU_: RESISTOR, European symbol
IC1 = atmel-avr32-michel-rev1_Martin:AT32UC3A3256/3128/364: AT32UC3A3xxx series 256/128/64 kB flash CPU max 84 MHz 64 kB RAM High-Speed USB 2.0 (480 Mbit/s) 110 GPIO 2 TWI 4 USART 2 SPI 1 SSC 6 Timer/Counter
IC2 = esd:TPD2E009DBZR: (6 GBPS) DIFFERENTIAL INTERFACE; MPN: TPD2E009DBZR; OC_FARNELL: 1755715; OC_NEWARK: 14R9549; PACKAGE: SOT-23-3; SUPPLIER: Texas Instruments
IC3 IC7 IC8 = v-reg:LP2950?*: Source: http://cache.national.com/ds/LP/LP2950.pdf
IC4 = _ALCZ_Mixed_signal_IC:CS2200: Fractional-N Frequency Synthesizer The CS2200-CP supports both I²C and SPI for full software control. by Martin Stejskal
IC5 = _ALCZ_Mixed_signal_IC:TLV320AIC33: Low Power Stereo Audio CODEC for Portable Audio/Telephony 16/20/24/32-Bit Data Supports Rates From 8 kHz to 96 kHz 3D/Bass/Treble/EQ/De-emphasis Effects by Martin Stejskal
IC6 IC10-IC14 = _ALCZ_Optocouplers_digital_isolators:SI8642: Low power quad-channel digital digital isolator common output enable up to 150 Mbps Operating supply voltage: 2.7-5.5V up to 5000 Urms isolation byMartin Stejskal
IC9 IC15 = _ALCZ_Optocouplers_digital_isolators:SI8645: Low power quad-channel digital digital isolator common output enable up to 150 Mbps Operating supply voltage: 2.7-5.5V up to 5000 Urms isolation by Martin Stejskal
JP1 = atmel-avr32-michel-rev1_Martin:AVR-JTAG-10: AVR JTAG Debug/Programming Header
JP2 = pinhead:PINHD-2X5: PIN HEADER
JP5 = jumper:JP2E: JUMPER
JP9 = jumper:JP1E: JUMPER
L1-L4 = _ALCZ_Passives:L: INDUCTOR chip
LED0 LED1-LED13 = led:LED: LED OSRAM: - CHIPLED LG R971, LG N971, LY N971, LG Q971, LY Q971, LO R971, LY R971 LH N974, LH R974 LS Q976, LO Q976, LY Q976 LO Q996 - Hyper CHIPLED LW Q18S LB Q993, LB Q99A, LB R99A - SideLED LS A670, LO A670, LY A670, LG A670, LP A670 LB A673, LV A673, LT A673, LW A673 LH A674 LY A675 LS A676, LA A676, LO A676, LY A676, LW A676 LS A679, LY A679, LG A679 - Hyper Micro SIDELED® LS Y876, LA Y876, LO Y876, LY Y876 LT Y87S - SmartLED LW L88C, LW L88S LB L89C, LB L89S, LG L890 LS L89K, LO L89K, LY L89K LS L896, LA L896, LO L896, LY L896 - TOPLED LS T670, LO T670, LY T670, LG T670, LP T670 LSG T670, LSP T670, LSY T670, LOP T670, LYG T670 LG T671, LOG T671, LSG T671 LB T673, LV T673, LT T673, LW T673 LH T674 LS T676, LA T676, LO T676, LY T676, LB T676, LH T676, LSB T676, LW T676 LB T67C, LV T67C, LT T67C, LS T67K, LO T67K, LY T67K, LW E67C LS E67B, LA E67B, LO E67B, LY E67B, LB E67C, LV E67C, LT E67C LW T67C LS T679, LY T679, LG T679 LS T770, LO T770, LY T770, LG T770, LP T770 LB T773, LV T773, LT T773, LW T773 LH T774 LS E675, LA E675, LY E675, LS T675 LS T776, LA T776, LO T776, LY T776, LB T776 LHGB T686 LT T68C, LB T68C - Hyper Mini TOPLED® LB M676 - Mini TOPLED Santana® LG M470 LS M47K, LO M47K, LY M47K Source: http://www.osram.convergy.de LUXEON: - LUMILED® LXK2-PW12-R00, LXK2-PW12-S00, LXK2-PW14-U00, LXK2-PW14-V00 LXK2-PM12-R00, LXK2-PM12-S00, LXK2-PM14-U00 LXK2-PE12-Q00, LXK2-PE12-R00, LXK2-PE12-S00, LXK2-PE14-T00, LXK2-PE14-U00 LXK2-PB12-K00, LXK2-PB12-L00, LXK2-PB12-M00, LXK2-PB14-N00, LXK2-PB14-P00, LXK2-PB14-Q00 LXK2-PR12-L00, LXK2-PR12-M00, LXK2-PR14-Q00, LXK2-PR14-R00 LXK2-PD12-Q00, LXK2-PD12-R00, LXK2-PD12-S00 LXK2-PH12-R00, LXK2-PH12-S00 LXK2-PL12-P00, LXK2-PL12-Q00, LXK2-PL12-R00 Source: www.luxeon.com KINGBRIGHT: KA-3528ASYC Source: www.kingbright.com
LED14-LED18 = _ALCZ_Discrete:DUO_LED_C: Two color LED witch common cathode
OK1 = optocoupler:LTV816: OPTO COUPLER Source: LITEON, LTV816.pdf; OC_FARNELL: unknown; OC_NEWARK: unknown
Q1 = crystal:CRYSTAL: CRYSTAL
R60 = _ALCZ_Passives:R-TRIM: trimmers
S1-S3 = switch-omron:10-XX: OMRON SWITCH; MPN: B3F-1000; OC_FARNELL: 176432; OC_NEWARK: 36M3542
SV1 = con-ml:ML14L: HARTING; OC_FARNELL: unknown; OC_NEWARK: unknown
SW1 = _ALCZ_Switch:THROUGH_HOLE_2_POLES_SHILED: Two pole through hole switches by Martin Stejskal
SW2 = _ALCZ_Switch:THROUGH_HOLE_1_POLE_SHIELD_1X: One pole through hole switches by Martin Stejskal
T1 = transistor:*-NPN_DRIVER-: NPN Bias Resistor Transistor
TP1-TP6 TP10 TP12 TP29 TP35 = testpad:PTR1: TEST PIN
X2 = con-cypressindustries:MINI-USB-SCHIELD-: MINI USB-B Conector Source: www.cypressindustries.com; OC_FARNELL: unknown; OC_NEWARK: unknown
X3 = _ALCZ_Conectors:JACK_CON_3.5MM_3PIN: Standard 3.5 jack female connector

## Net classes
0 default: width 0.254 mm, drill 0.5 mm, clearance 0.2 mm
1 High Speed: width 0.254 mm, drill 0.5 mm, clearance 0.508 mm